# EAGLE design U64_KB_Ada (EAGLE 9.5.2)
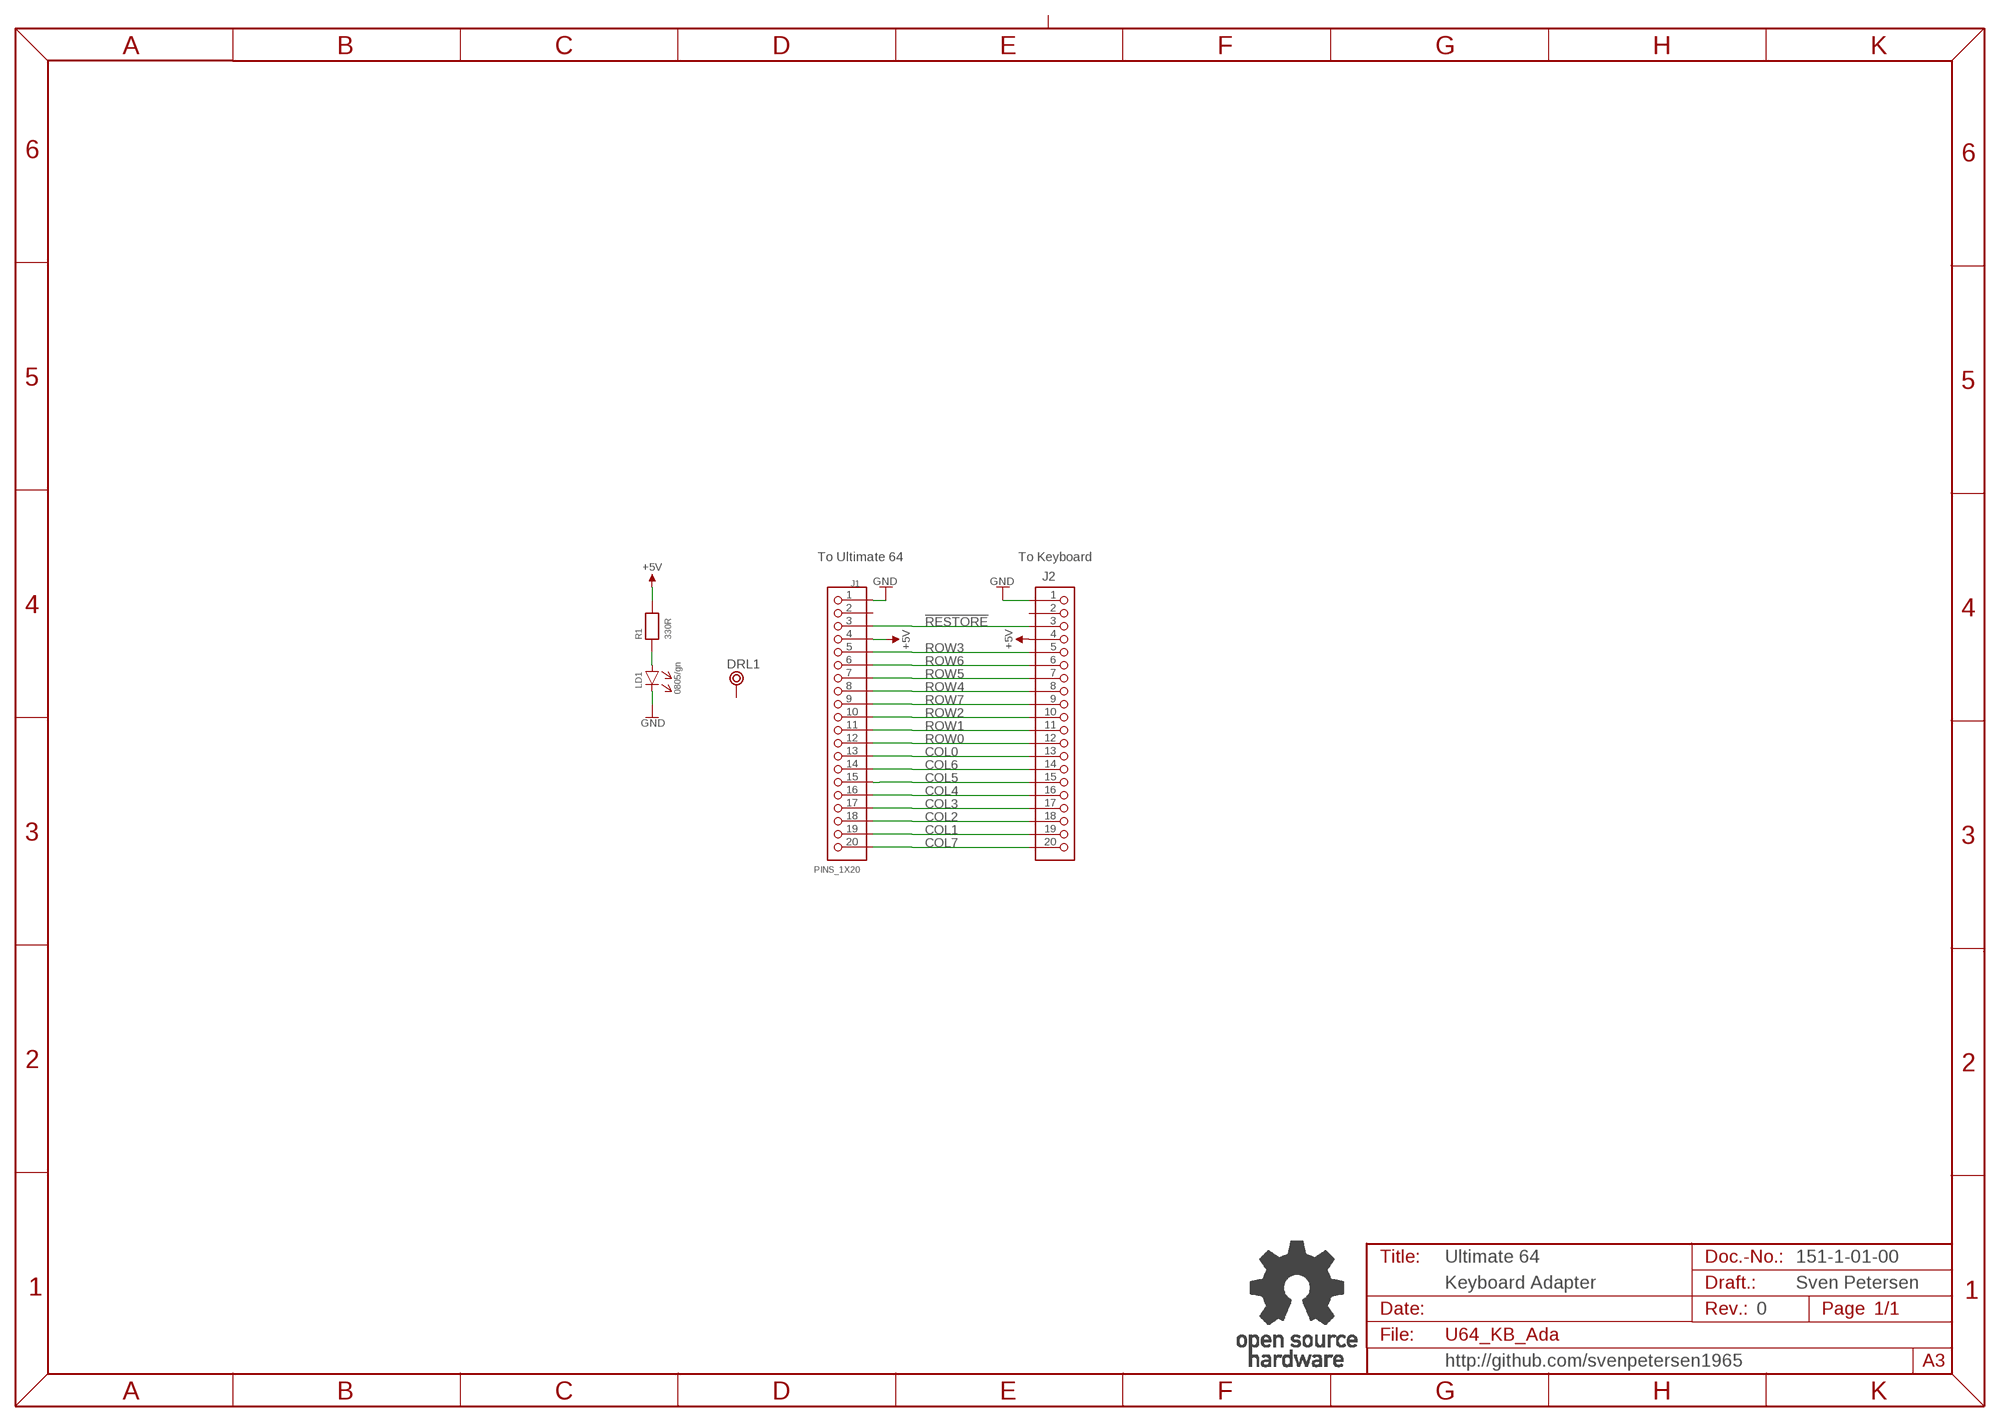
[diagram p0: schematic, sheet 1]

## Parts
DRL1  BOHR3,5  [BOHR3,5]
J1  PINS_1X20  [PINS_1X20V]
J2  PINHD-1X20  [1X20]
LD1  0805/gn  0805-LED  [0805]
R1  330R  R-0805  [0805]
U$12  OPEN_SOURCE_HW  [OPENHW]

## Nets
!RESTORE: J1.3 J2.3
+5V: J1.4 J2.4 R1.2
COL0: J1.13 J2.13
COL1: J1.19 J2.19
COL2: J1.18 J2.18
COL3: J1.17 J2.17
COL4: J1.16 J2.16
COL5: J1.15 J2.15
COL6: J1.14 J2.14
COL7: J1.20 J2.20
GND: J1.1 J2.1 LD1.K
N$1: LD1.A R1.1
ROW0: J1.12 J2.12
ROW1: J1.11 J2.11
ROW2: J1.10 J2.10
ROW3: J1.5 J2.5
ROW4: J1.8 J2.8
ROW5: J1.7 J2.7
ROW6: J1.6 J2.6
ROW7: J1.9 J2.9
Unconnected: DRL1.P$1 J1.2 J2.2

## Notes on the sheet
- To Ultimate 64 | To Keyboard
- Ultimate 64 | 151-1-01-00
- Keyboard Adapter | Sven Petersen
- 0
- http://github.com/svenpetersen1965

## Library data of the parts
DRL1 = Mech_Bohr:BOHR3,5
J1 = Pin_Socket:PINS_1X20
J2 = PINHEAD:PINHD-1X20
LD1 = LED:0805-LED
R1 = SMD:R-0805
U$12 = Logo:OPEN_SOURCE_HW

## Board
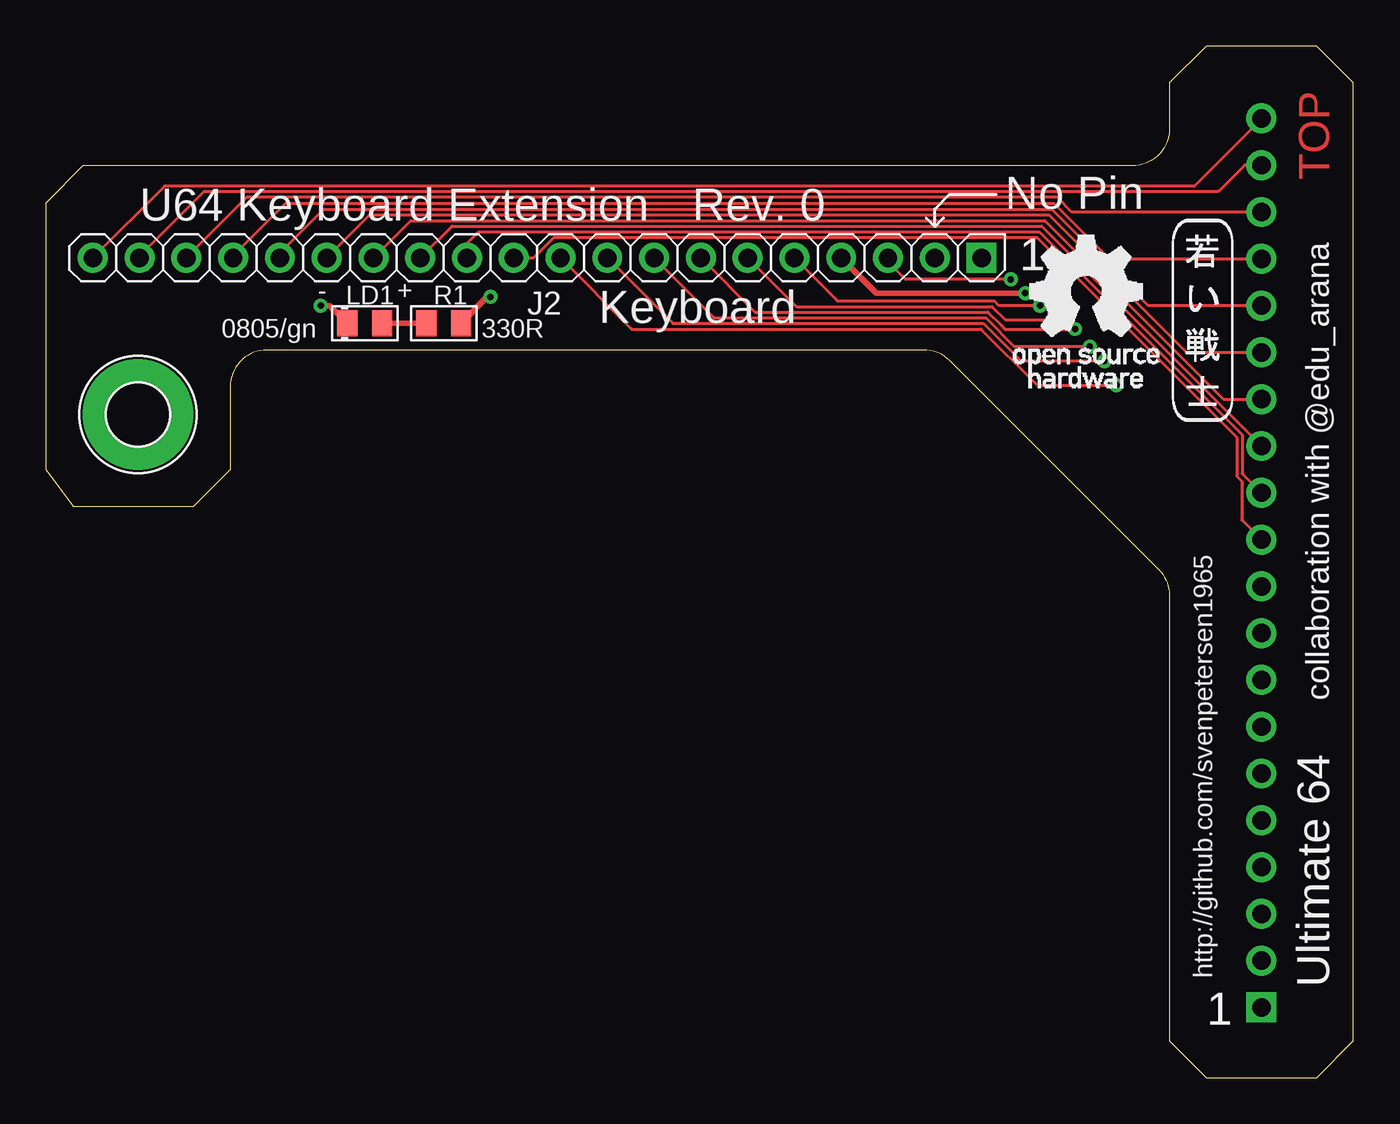
[diagram p1: board, top side]
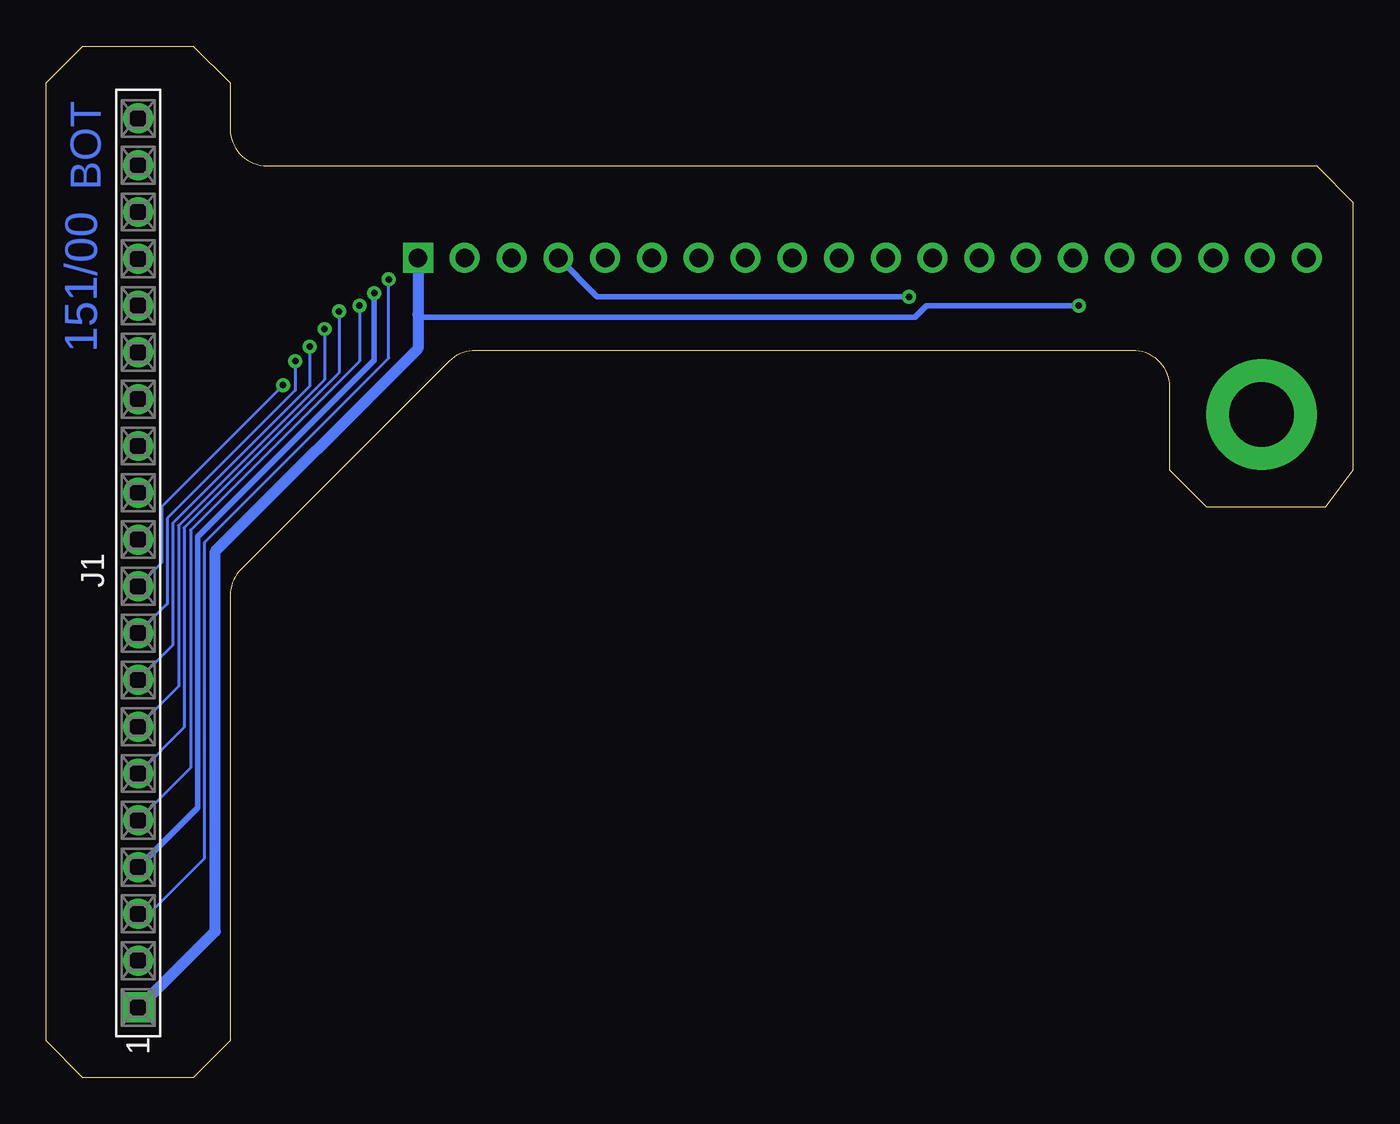
[diagram p2: board, bottom side, seen from below]

Size 71 x 56 mm. Coordinates in mm from the lower left corner, seen from the top.
Outline: 61,26.17 61,2 63,0 69,0 71,2 71,54 69,56 63,56 61,54 61,51.5 arc-90 59,49.5 2,49.5 0,47.5 0,33 1.5,31 8,31 10,33 10,37.5 arc-90 12,39.5 47.67,39.5 arc-45 49.09,38.91 60.41,27.59 arc-45 61,26.17
Copper layers (1*16): Top 0.035mm / dielectric 1.5mm / Bottom 0.035mm
Design rules "default *": minimum track width 6mil, minimum drill 0.35mm, track to track 6mil, track to pad 6mil, pad to pad 6mil, via to via 6mil, smd to smd 6mil, copper to edge 20mil, drill to drill 6mil, minimum pad ring 10mil, minimum via ring 8mil, stop-mask expansion 4mil, vias tented up to drill 25mil, thermal gap 10mil

### Footprints (pad centres in the part's own frame; a part is rotated, then mirrored left to right if it is on the bottom)
BOHR3,5 = drill 3.5 pad 6: P$1 0,0
PINS_1X20V = drill 1 pad 1.626 square: 1 -24.13,0 | drill 1 pad 1.626: 2 -21.59,0; 3 -19.05,0; 4 -16.51,0; 5 -13.97,0; 6 -11.43,0; 7 -8.89,0; 8 -6.35,0; 9 -3.81,0; 10 -1.27,0; 11 1.27,0; 12 3.81,0; 13 6.35,0; 14 8.89,0; 15 11.43,0; 16 13.97,0; 17 16.51,0; 18 19.05,0; 19 21.59,0; 20 24.13,0
1X20 = drill 1 pad 1.626 square: 1 -24.13,0 | drill 1 pad 1.626: 2 -21.59,0; 3 -19.05,0; 4 -16.51,0; 5 -13.97,0; 6 -11.43,0; 7 -8.89,0; 8 -6.35,0; 9 -3.81,0; 10 -1.27,0; 11 1.27,0; 12 3.81,0; 13 6.35,0; 14 8.89,0; 15 11.43,0; 16 13.97,0; 17 16.51,0; 18 19.05,0; 19 21.59,0; 20 24.13,0
0805 = smd 1.092 x 1.397: A -0.94,0; K 0.94,0
0805' = smd 1.092 x 1.397: 1 -0.94,0; 2 0.94,0

### Placement (x,y rotation side)
DRL1  5,36 0 top
J1  66,27.94 90 bottom
J2  26.67,44.5 180 top
LD1  17.3,40.96 180 top
R1  330R  [0805']  21.59,40.96 0 top
U$6  [2LAYER]  69.69,48.74 90 top
U$9  [SVEN_TAG]  62.85,41.23 0 top
U$10  [PCB-TITLE/]  0,66.2 0 top  (outside the outline)
U$12  52.55,37.47 0 top

### Tracks (layer width: path | path; a pad name or v marks a point on that pad's centre or on a via)
!RESTORE  (via drill 0.35)
  Top 0.152: v52.39,43.34 46.67,43.34 45.72,44.29 J2.3
  Bottom 0.152: J1.3 65.41,8.89 62.39,11.91 62.39,29.05 52.39,39.05 v52.39,43.34
+5V  (via drill 0.35)
  Top 0.305: J2.4 45.09,42.59 v53.18,42.59 | R1.2 23.96,42.39 v24.13,42.39
  Bottom 0.305: J1.4 62.77,14.66 62.77,29.35 53.18,38.94 v53.18,42.59 | v24.13,42.39 41.07,42.39 J2.4
COL0
  Top 0.152: J2.13 22.04,46.22 54.07,46.22 J1.13
COL1
  Top 0.152: J1.19 65.09,49.53 63.66,48.1 8.57,48.1 5.08,44.61 J2.19
COL2
  Top 0.152: J1.18 55.72,46.99 54.93,47.78 10.9,47.78 J2.18
COL3
  Top 0.152: J2.17 10.16,44.61 13.02,47.47 54.73,47.47 57.74,44.45 J1.17
COL4
  Top 0.152: J2.16 12.7,44.77 15.08,47.15 54.61,47.15 59.85,41.91 J1.16
COL5
  Top 0.152: J2.15 17.57,46.83 54.45,46.83 61.91,39.37 J1.15
COL6
  Top 0.152: J2.14 19.81,46.53 54.24,46.53 63.94,36.83 J1.14
COL7
  Top 0.152: J2.20 6.46,48.42 62.39,48.42 66,52.03 J1.20
GND  (via drill 0.35)
  Top 0.305: LD1.K 15.41,41.91 v14.92,41.91
  Bottom 0.305: v14.92,41.91 23.18,41.91 23.81,41.27 50.64,41.27 50.8,41.43
  Bottom 0.61: J1.1 65.94,3.81 61.81,7.94 61.81,28.57 50.8,39.58 50.8,41.43 J2.1
N$1
  Top 0.305: R1.1 LD1.A
ROW0
  Top 0.152: J2.12 22.86,45.28 23.5,45.92 53.94,45.92 64.96,34.9 64.96,32.79 J1.12
ROW1
  Top 0.152: J2.11 26.47,44.5 27.58,45.61 53.81,45.61 64.65,34.77 64.65,32.66 64.93,32.38 64.93,30.28 J1.11
ROW2  (via drill 0.35)
  Top 0.152: v58.13,37.59 53.83,37.59 50.78,40.64 31.8,40.64 J2.10
  Bottom 0.152: v58.13,37.59 v58.12,37.58 64.72,30.98 64.72,27.95 J1.10
ROW3  (via drill 0.35)
  Top 0.152: J2.5 42.98,42.16 51.5,42.16 51.75,41.91 v53.98,41.91
  Bottom 0.152: v53.98,41.91 53.98,38.89 63.15,29.72 63.15,16.82 J1.5
ROW4  (via drill 0.35)
  Top 0.152: v56.67,39.69 52.59,39.69 51.03,41.25 36.27,41.25 J2.8
  Bottom 0.152: J1.8 64.11,23.48 64.11,30.1 56.67,37.53 v56.67,39.69
ROW5  (via drill 0.35)
  Top 0.152: J2.7 38.51,41.55 51.16,41.55 51.87,40.84 52.07,40.64 v55.88,40.64
  Bottom 0.152: v55.88,40.64 55.88,37.9 63.8,29.97 63.8,21.25 J1.7
ROW6  (via drill 0.35)
  Top 0.152: v55.09,41.59 54.64,41.14 52.09,41.14 51.37,41.86 40.74,41.86 J2.6
  Bottom 0.152: J1.6 63.5,19.01 63.5,29.84 55.09,38.26 v55.09,41.59
ROW7  (via drill 0.35)
  Top 0.152: J2.9 34.03,40.95 50.9,40.95 52.94,38.91 57.47,38.91 v57.47,38.89
  Bottom 0.152: v57.47,38.89 57.47,37.31 64.41,30.36 64.41,25.72 J1.9

### Text on the board
Bottom: 151/00
tPlace: U64 Keyboard Extension | Rev. 0 | No Pin | 1 | - | + | Keyboard | 0805/gn | 330R | collaboration with @edu_arana | http://github.com/svenpetersen1965 | Ultimate 64 | 1
Measures: all miter: 2.00 / all radius: 2.00
Document: 151-2-01-00 | Sven Petersen / 2020 | 35µm | 2 | 0